# Altium project B226_NINA-B302_carrier_mid.PrjPcb
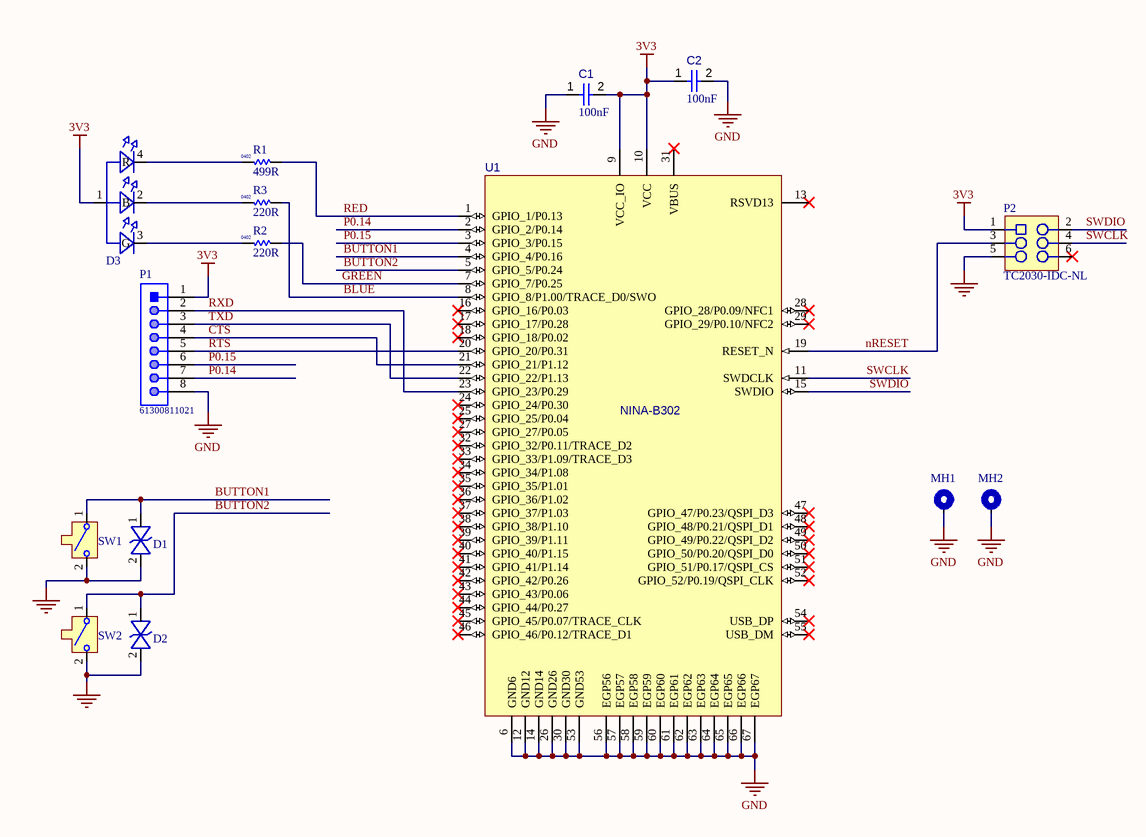
[diagram p0: B226.SchDoc]
SchSheetTotal: 1; SchDocNum: B226; ReleaseRev3: -; ReleaseRev2: B; ReleaseRev1: A; ReleaseDesc3: -; ReleaseDesc2: Corrected RTS/CTS; ReleaseDesc1: Initial Release; ReleaseDate3: -; ReleaseDate2: 2021-09-02; ReleaseDate1: 2020-10-23; ReleaseBy3: -; ReleaseBy2: BREC; ReleaseBy1: LKIS; ProjectEngineer: LKIS; PCBName: B226 NINA-B302 CM; PCBDocNum: B226; GlobalReleaseDate: 2020-10-23; GlobalProjectTeam: u-blox AG; GlobalProjectRevision: B; GlobalProjectName: TE_SUP_ANT; GlobalProjectLink: www.u-blox.com; GlobalClientName: u-blox
1 sheet, 17 parts. Net scope: global (net labels, ports and power ports of the same name join across sheets).
Board file: B226.PcbDoc

## Sheet B226.SchDoc: Sheet Name
size B; Website: www.rigado.com; SheetTitle: Sheet Title; DrawnBy: Your Name; SheetNumber: 1; SheetTotal: X; SheetSize: B

### Parts
(Parts that share a designator on the sheet are numbered #1, #2 ... from top to bottom, then left to right.)
?#1  (no value)  (graphical)
?#2  (no value)  (graphical)
C1  value 100nF  [CAPC1005X56X25ML10T15]  (hidden comment: Capacitor 0.1 uF +/- 5% 16 V 0402)
C2  value 100nF  [CAPC1005X56X25ML10T15]  (hidden comment: Capacitor 0.1 uF +/- 5% 16 V 0402)
D1  (no value)  [SOD-923]
D2  (no value)  [SOD-923]
D3  (no value)  [4-PLCC]
MH1  MH_M1.5DNP  [MH_M1.5]  (value not drawn)
MH2  MH_M1.5DNP  [MH_M1.5]  (value not drawn)
P1  61300811021  [61300811021]
P2  TC2030-IDC-NLDNP  [TC2030-IDC-NL]  (value not drawn)
R1  value 499R  Size: 0402  [RES 0402 HD]
R2  value 220R  Size: 0402  [RES 0402 HD]
R3  value 220R  Size: 0402  [RES 0402 HD]
SW1  (no value)  [B3U-1000P]
SW2  (no value)  [B3U-1000P]
U1  NINA-B302  [NINA_LGA67R_1500X1000X338_PIFA]

### Nets
3V3: C1.2 C2.1 D3.1(A) P1.1 P2.1 U1.9(VCC_IO) U1.10(VCC)
GND: C1.1 C2.2 D1.2 D2.2 MH1.1 MH2.1 P1.8 P2.5 SW1.2 SW2.2 U1.6(GND6) U1.12(GND12) U1.14(GND14) U1.26(GND26) U1.30(GND30) U1.53(GND53) U1.56(EGP56) U1.57(EGP57) U1.58(EGP58) U1.59(EGP59) U1.60(EGP60) U1.61(EGP61) U1.62(EGP62) U1.63(EGP63) U1.64(EGP64) U1.65(EGP65) U1.66(EGP66) U1.67(EGP67)
BLUE: R3.1 U1.8(GPIO_8/P1.00/TRACE_D0/SWO)
BUTTON1: D1.1 SW1.1 U1.4(GPIO_4/P0.16)
BUTTON2: D2.1 SW2.1 U1.5(GPIO_5/P0.24)
CTS: P1.4 U1.21(GPIO_21/P1.12)
GREEN: R2.1 U1.7(GPIO_7/P0.25)
nRESET: P2.3 U1.19(RESET_N)
P0.14: P1.7 U1.2(GPIO_2/P0.14)
P0.15: P1.6 U1.3(GPIO_3/P0.15)
RED: R1.1 U1.1(GPIO_1/P0.13)
RTS: P1.5 U1.20(GPIO_20/P0.31)
RXD: P1.2 U1.23(GPIO_23/P0.29)
SWCLK: P2.4 U1.11(SWDCLK)
SWDIO: P2.2 U1.15(SWDIO)
TXD: P1.3 U1.22(GPIO_22/P1.13)
NetD3_2: D3.2(B) R3.2
NetD3_3: D3.3(G) R2.2
NetD3_4: D3.4(R) R1.2

Not connected (* = marked no-connect by the designer): P2 6*; U1 13(RSVD13)* 16(GPIO_16/P0.03)* 17(GPIO_17/P0.28)* 18(GPIO_18/P0.02)* 24(GPIO_24/P0.30)* 25(GPIO_25/P0.04)* 27(GPIO_27/P0.05)* 28(GPIO_28/P0.09/NFC1)* 29(GPIO_29/P0.10/NFC2)* 31(VBUS)* 32(GPIO_32/P0.11/TRACE_D2)* 33(GPIO_33/P1.09/TRACE_D3)* 34(GPIO_34/P1.08)* 35(GPIO_35/P1.01)* 36(GPIO_36/P1.02)* 37(GPIO_37/P1.03)* 38(GPIO_38/P1.10)* 39(GPIO_39/P1.11)* 40(GPIO_40/P1.15)* 41(GPIO_41/P1.14)* 42(GPIO_42/P0.26)* 43(GPIO_43/P0.06)* 44(GPIO_44/P0.27)* 45(GPIO_45/P0.07/TRACE_CLK)* 46(GPIO_46/P0.12/TRACE_D1)* 47(GPIO_47/P0.23/QSPI_D3)* 48(GPIO_48/P0.21/QSPI_D1)* 49(GPIO_49/P0.22/QSPI_D2)* 50(GPIO_50/P0.20/QSPI_D0)* 51(GPIO_51/P0.17/QSPI_CS)* 52(GPIO_52/P0.19/QSPI_CLK)* 54(USB_DP)* 55(USB_DM)*

### Notes on the sheet
- Rev.
- Description
- Revision
- Date
- By
- Prepared By
- Revision:
- CONFIDENTIAL
- Page:

### Library data of the parts
?#1 = Top_Revision_Block: Release Revision History Block
?#2 = Top_Title_Block: Top level schematic title block for top level sheet
C1 C2 = CMP-001-00001-4: Chip Capacitor, 0.1 uF, +/- 5%, 16 V, 0402 (1005 Metric); Voltage Rating: 16V; Capacitor Type: Ceramic; Pins: 2; Min Operating Temperature: -55°C; Mounting Technology: SM; Max Operating Temperature: 125°C; RoHS Compliant: True; Case/Package: 0402; Tolerance: 5%
D1 D2 = 110-00019: Diode, ESD9B, 3.3V, ST5G, SOD-923; Part Name: Diode TVS 3.3V SOD-923; Manufacturer: ON Semiconductor; Manufacturer P/N: ESD9B3.3ST5G; Item_Phase: Production; Body Size: 0.8mm x 0.6mm; Component Mounting Type: SMT; Diode Type: TVS; Use in new designs: Yes; Part Number: 110-00019; Part_Type: Diode; Revision: 0A; Supplier 1: Arrow; Supplier Part Number 1: ESD9B3.3ST5G; Arena Link: https://app.bom.com/a/4M5DJQ9Q9SR7DV4H?v=spec.summary; Height: 0.4mm; MFG Package: SOD-923; Package Type: SOD; Pins: 2; Voltage: 3.3V
D3 = 115-00011: LED, RGB Diffused SMT, PLCC4 4 Pin; Part Name: LED RGB SMT 2mm x 2mm; Manufacturer: Cree, Inc.; Manufacturer P/N: CLMVB-FKA-CFHEHLCBB7a363; Item_Phase: Production; Body Size: 2.0mm x 2.0mm; Current: 20mA Red, 10mA Green, 10mA, Blue; Number of Circuits: 3; Use in new designs: Yes; Vf: 2V Red, 3V Green, 3V Blue; Voltage: 5V; Part Number: 115-00011; Part_Type: LED; Revision: 0A; Supplier 1: Mouser; Supplier Part Number 1: 941-CLMVBFKACFHEHLCB; Arena Link: https://app.bom.com/a/UCV39GZGZIHY581D?v=spec.summary; Color: RGB; Component Mounting Type: SMT; Height: 1mm; MFG Package: PLCC4; Mounting Type: Vertical; Package Type: Custom; Pins: 4
MH1 MH2 = MH_M1.5: 1.5M screw mounting hole, plated; Added By: Jeremy D; Part Number: MH_M1.5; Size: 3.4mm x 3.4mm; Height: 0mm; Type: Mounting Hole; DNP: DNP; Added Date: 2015-07-09
P1 = CMP-1502-01075-1: THT Angled Pin Header WR-PHD, Pitch 2.54 mm, Single Row, 8 pins; Manufacturer: Wurth Elektronik; Manufacturer: Wurth Electronics; Pin Number: 8; Rated Current: 3A; Working Voltage: 250VAC; Withstanding Voltage: 500VAC; Gender: Male; Contact Resistance: 20mOhm; Pitch: 2.54mm; Part Number: 61300811021; Publisher: WurthElektronik; Manufacturer URL: http://www.we-online.de; Row Number: Single; Datasheet URL: https://katalog.we-online.de/em/datasheet/6130xx11021.pdf; Orientation: Angled; Operating Temperature: -40to105degC; Mounting Technology: THT; Package Reference: 61300811021; Packaging: Bag; Manufacturer Part Number: 61300811021
P2 = TC2030-IDC-NL: CON PADS FOR CBL PLUG-OF-NAILS 6-PIN NO LEGS; Manufacturer: TAG Connect; Added By: Paul B; Manufacturer P/N: TC2030-IDC-NL; Part Number: TC2030-IDC-NL; Size: 6.731mm x 12.446mm; Height: 0; DNP: DNP; Added Date: 2015-04-22
R1 = 180-00031: Resistor, 499ohm, 1%, 1/16W, 0402; Part Name: RES SMD 499 OHM 1% 1/16W 0402; Manufacturer: Rohm Semiconductor; Manufacturer P/N: MCR01MRTF4990; Item_Phase: Production; Component Mounting Type: SMT; Tolerance: +/- 1%; Use in new designs: Yes; Part Number: 180-00031; Part_Type: Resistor; Supplier 1: Digi-Key; Supplier Part Number 1: RHM499CDCT-ND; Manufacturer 2: Samsung Electro-Mechanics America, Inc; Manufacturer P/N 2: RC1005F4990CS; Arena Link: https://app.bom.com/a/Q8RZ5CVCVEDU1SS5?v=spec.summary; Height: 0.4mm; Pins: 2; Power: 1/16W; Revision: 0D; Supplier 2: Digi-Key; Supplier Part Number 2: 1276-3992-1-ND; Alternate Footprint Ref: RES 0402
R2 R3 = 180-00098: Resistor, 220ohm, 5%, 1/16W, 0402.; Part Name: RES SMD 220 OHM 5% 1/16W 0402; Manufacturer: Panasonic Electronic Components; Manufacturer P/N: ERJ-2GEJ221X; Item_Phase: Production; Component Mounting Type: SMT; Tolerance: +/- 5%; Use in new designs: Yes; Part Number: 180-00098; Part_Type: Resistor; Supplier 1: Digi-Key; Supplier Part Number 1: P220JCT-ND; Arena Link: https://app.bom.com/a/8Q9HNUDUDWVBJC30?v=spec.summary; Pins: 2; Power: 1/16W; Revision: 0C; Manufacturer 2: Samsung Electro-Mechanics America, Inc; Manufacturer P/N 2: RC1005J221CS; Supplier 2: Digi-Key; Supplier Part Number 2: 1276-4360-1-ND; Alternate Footprint Ref: RES 0402; Height: 0.4mm
SW1 SW2 = 135-00007: Button, Momentary SPST-NO, 0.05A, 12V, 3mm x 2.5mm; Part Name: SWITCH TACTILE SPST-NO 0.05A 12V; Manufacturer: Omron Electronics Inc-EMC Div; Item_Phase: Production; Component Mounting Type: SMT; Current: 50mA; Switch/Button Circuit: SPST; Switch/Button Function: Off-Mom; Use in new designs: Yes; Voltage: 12VDC; Part Number: 135-00007; Part_Type: Button; Revision: 0A; Manufacturer P/N: B3U-1000P; Supplier 1: Digi-Key; Supplier Part Number 1: SW1020CT-ND; Arena Link: https://app.bom.com/a/TBU28FYFYHGV5FQ0?v=spec.summary; Body Size: 3mm x 2.5mm; Height: 1.2mm; Pins: 2
U1 = NINA-B302: Stand-alone Bluetooth low energy module; Manufacturer: u-blox; Part Description: Stand-alone Bluetooth low energy module; Value: NINA-B302

## Assembly variants
B226_NINA-B302_carrier_mid: not fitted MH1 MH2 P2